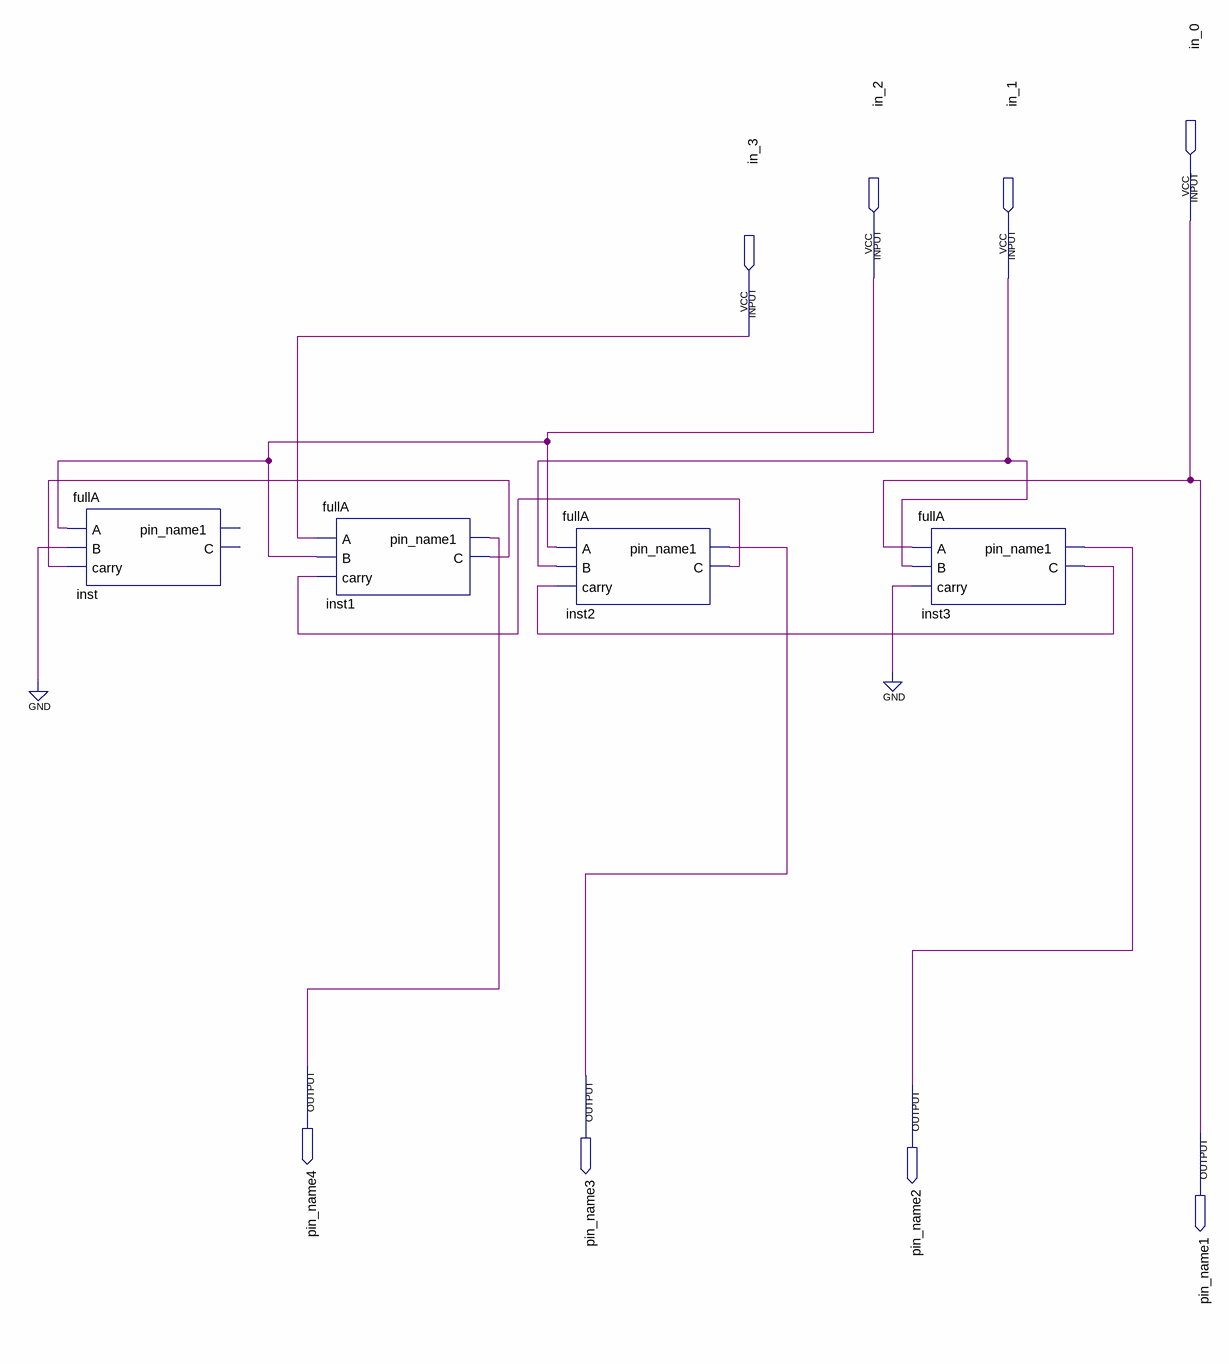
[diagram p0: schematic sheet]
// Quartus schematic multV2.bdf as structural Verilog: 4 symbols, 8 pins
module multV2 (
  input  in_0,
  input  in_2,
  input  in_1,
  input  in_3,
  output pin_name4,
  output pin_name3,
  output pin_name2,
  output pin_name1
);

  wire inst1_c, inst2_c, inst3_c;

  fullA inst (.A(in_2), .B(1'b0), .carry(inst1_c));  // open: pin_name1, C
  fullA inst1 (.A(in_3), .B(in_2), .carry(inst2_c), .pin_name1(pin_name4), .C(inst1_c));
  fullA inst2 (.A(in_2), .B(in_1), .carry(inst3_c), .pin_name1(pin_name3), .C(inst2_c));
  fullA inst3 (.A(in_0), .B(in_1), .carry(1'b0), .pin_name1(pin_name2), .C(inst3_c));

  assign pin_name1 = in_0;
endmodule
